# Altium schematic sheet IMU.SchDoc
size B; SheetNumber: 4; SheetTotal: 7
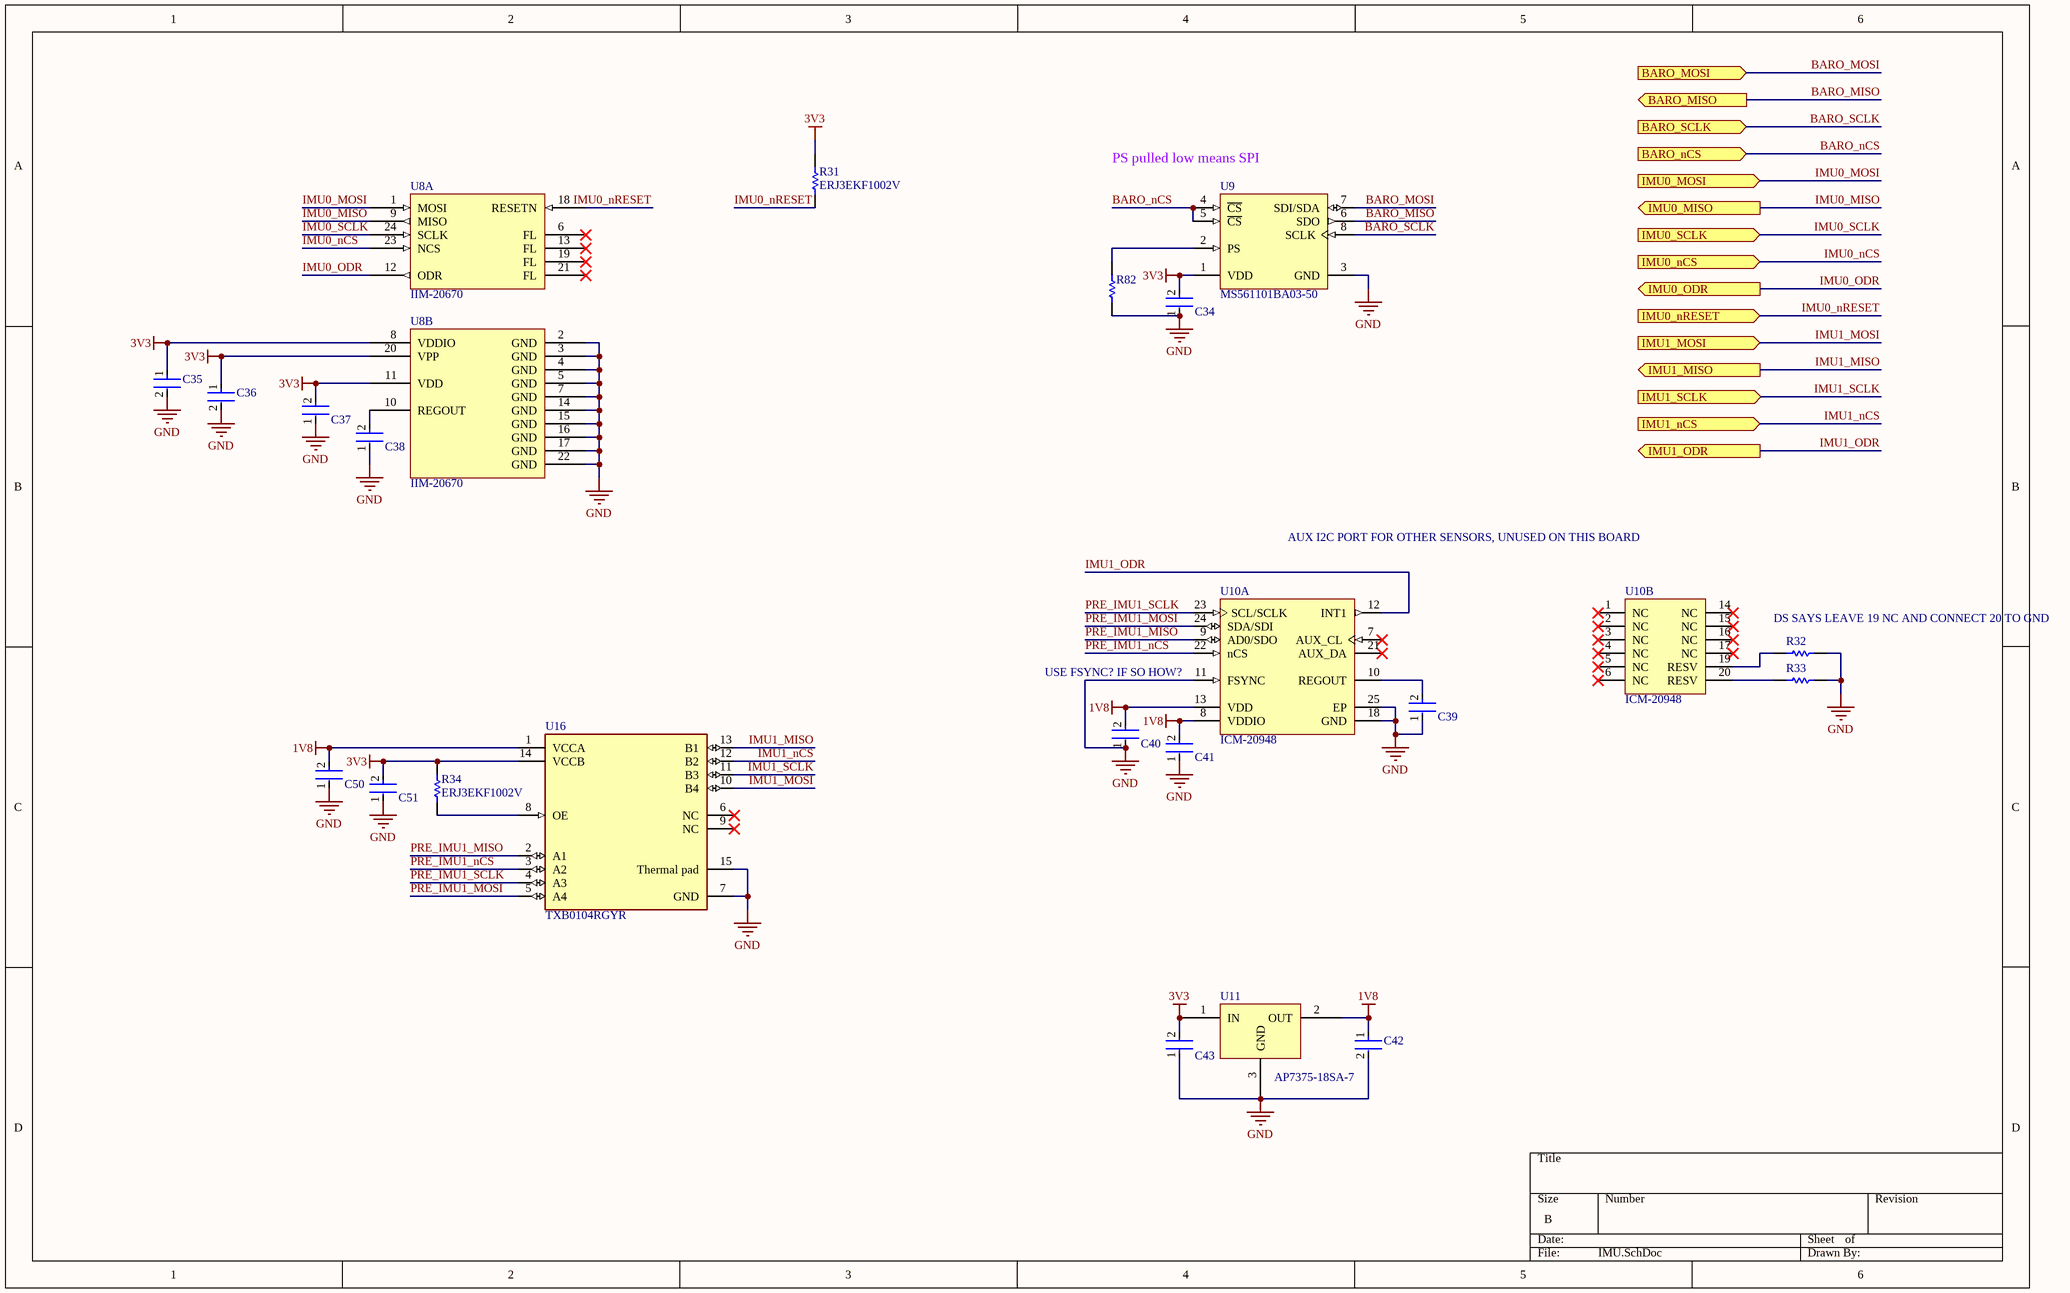
[diagram p0: IMU.SchDoc]

## Parts
C34  GRM155R71C104KA88D  [FP-GRM15-MFG]  (value not drawn)
C35  CC0402KPX7R7BB103  [FP-CC0402-MFG]  (value not drawn)
C36  CC0402KPX7R7BB103  [FP-CC0402-MFG]  (value not drawn)
C37  GRM155R71C104KA88D  [FP-GRM15-MFG]  (value not drawn)
C38  GRM155R71C104KA88D  [FP-GRM15-MFG]  (value not drawn)
C39  GRM155R71C104KA88D  [FP-GRM15-MFG]  (value not drawn)
C40  GRM155R71C104KA88D  [FP-GRM15-MFG]  (value not drawn)
C41  GRM155R71C104KA88D  [FP-GRM15-MFG]  (value not drawn)
C42  CL05A106MP5NUNC  [FP-CL05A106MP5NUNC-MFG]  (value not drawn)
C43  C0402C104K8PACTU  [FP-C0402-BB-MFG]  (value not drawn)
C50  GRM155R71C104KA88D  [FP-GRM15-MFG]  (value not drawn)
C51  GRM155R71C104KA88D  [FP-GRM15-MFG]  (value not drawn)
R31  ERJ3EKF1002V  [RESC1609X55X30LL15T15]
R32  0402 JUMPER  [RESC1005X40X25ML05T05]  (value not drawn)
R33  0402 JUMPER  [RESC1005X40X25ML05T05]  (value not drawn)
R34  ERJ3EKF1002V  [RESC1609X55X30LL15T15]
R82  0402 JUMPER  [RESC1005X40X25ML05T05]  (value not drawn)
U8  IIM-20670  [PQFN50P450X450X115_HS-25N]  (parts A,B of 2)
U9  MS561101BA03-50  [MSI-MS561101BA03-50-8_V]
U10  ICM-20948  [TDK-QFN-24_L]  (parts A,B of 2)
U11  AP7375-18SA-7  [AP7375-18SA-7-Footprint-1]
U16  TXB0104RGYR  [FP-RGY0014A-MFG]

## Ports
BARO_MISO (out, see HYDRA_V3_NAV[5A], STM32H730_PINOUT[7A]), BARO_MOSI (in, see HYDRA_V3_NAV[5A], STM32H730_PINOUT[7A]), BARO_nCS (in, see HYDRA_V3_NAV[5B], STM32H730_PINOUT[7A]), BARO_SCLK (in, see HYDRA_V3_NAV[5A], STM32H730_PINOUT[7A]), IMU0_MISO (out, see HYDRA_V3_NAV[5A], STM32H730_PINOUT[7A]), IMU0_MOSI (in, see HYDRA_V3_NAV[5A], STM32H730_PINOUT[7A]), IMU0_nCS (in, see HYDRA_V3_NAV[5A], STM32H730_PINOUT[7A]), IMU0_nRESET (in, see HYDRA_V3_NAV[5A]), IMU0_ODR (out, see HYDRA_V3_NAV[5A]), IMU0_SCLK (in, see HYDRA_V3_NAV[5A], STM32H730_PINOUT[7A]), IMU1_MISO (out, see HYDRA_V3_NAV[5A], STM32H730_PINOUT[7A]), IMU1_MOSI (in, see HYDRA_V3_NAV[5A], STM32H730_PINOUT[7A]), IMU1_nCS (in, see HYDRA_V3_NAV[5A], STM32H730_PINOUT[7A]), IMU1_ODR (out, see HYDRA_V3_NAV[5A], STM32H730_PINOUT[7A]), IMU1_SCLK (in, see HYDRA_V3_NAV[5A], STM32H730_PINOUT[7A])

## Nets
1V8: C40.2 C41.2 C42.1 C50.2 U10.8(VDDIO) U10.13(VDD) U11.2(OUT) U16.1(VCCA)
3V3: C34.2 C35.1 C36.1 C37.2 C43.2 C51.2 R31.2 R34.2 U8.8(VDDIO) U8.11(VDD) U8.20(VPP) U9.1(VDD) U11.1(IN) U16.14(VCCB)
GND: C34.1 C35.2 C36.2 C37.1 C38.1 C39.1 C40.1 C41.1 C42.2 C43.1 C50.1 C51.1 R32.2 R33.2 R82.1 U8.2(GND) U8.3(GND) U8.4(GND) U8.5(GND) U8.7(GND) U8.14(GND) U8.15(GND) U8.16(GND) U8.17(GND) U8.22(GND) U9.3(GND) U10.11(FSYNC) U10.18(GND) U10.25(EP) U11.3(GND) U16.7(GND) U16.15(Thermal_pad)
BARO_MISO: U9.6(SDO) ; port BARO_MISO
BARO_MOSI: U9.7(SDI/SDA) ; port BARO_MOSI
BARO_nCS: U9.4(~{CS}) U9.5(~{CS}) ; port BARO_nCS
BARO_SCLK: U9.8(SCLK) ; port BARO_SCLK
IMU0_MISO: U8.9(MISO) ; port IMU0_MISO
IMU0_MOSI: U8.1(MOSI) ; port IMU0_MOSI
IMU0_nCS: U8.23(NCS) ; port IMU0_nCS
IMU0_nRESET: R31.1 U8.18(RESETN) ; port IMU0_nRESET
IMU0_ODR: U8.12(ODR) ; port IMU0_ODR
IMU0_SCLK: U8.24(SCLK) ; port IMU0_SCLK
IMU1_MISO: U16.13(B1) ; port IMU1_MISO
IMU1_MOSI: U16.10(B4) ; port IMU1_MOSI
IMU1_nCS: U16.12(B2) ; port IMU1_nCS
IMU1_ODR: U10.12(INT1) ; port IMU1_ODR
IMU1_SCLK: U16.11(B3) ; port IMU1_SCLK
PRE_IMU1_MISO: U10.9(AD0/SDO) U16.2(A1)
PRE_IMU1_MOSI: U10.24(SDA/SDI) U16.5(A4)
PRE_IMU1_nCS: U10.22(nCS) U16.3(A2)
PRE_IMU1_SCLK: U10.23(SCL/SCLK) U16.4(A3)
NetC38_2: C38.2 U8.10(REGOUT)
NetC39_2: C39.2 U10.10(REGOUT)
NetR32_1: R32.1 U10.19(RESV)
NetR33_1: R33.1 U10.20(RESV)
NetR34_1: R34.1 U16.8(OE)
NetR82_2: R82.2 U9.2(PS)

Not connected (* = marked no-connect by the designer): U8 6(FL)* 13(FL)* 19(FL)* 21(FL)*; U10 1(NC)* 2(NC)* 3(NC)* 4(NC)* 5(NC)* 6(NC)* 7(AUX_CL)* 14(NC)* 15(NC)* 16(NC)* 17(NC)* 21(AUX_DA)*; U16 6(NC)* 9(NC)*

## Notes on the sheet
- (near U9) PS pulled low means SPI
- AUX I2C PORT FOR OTHER SENSORS, UNUSED ON THIS BOARD
- (near R32) DS SAYS LEAVE 19 NC AND CONNECT 20 TO GND
- USE FSYNC? IF SO HOW?

## Library data of the parts
C34 C37-C41 C50 C51 = CMP-2100-03641-2: CAP CER 0.1UF 16V X7R 0402; Manufacturer: Murata; Standoff Height: 0mm; Tolerance: 10%; Voltage Rating: 16Vdc; Material: Ceramic; Capacitance: 0.10μF; Value: 0.10μF; RoHS: TRUE; Manufacturer Part Number: GRM155R71C104KA88D; Temperature Characteristic: X7R; Octopart: https://octopart.com/grm155r71c104ka88d-murata-196880; Digikey Description: CAP CER 0.1UF 16V X7R 0402; Device Class L3: Ceramic Capacitors; Height: 0.55mm; ComponentLink2Description: Datasheet; Temperature Range Low: -55°C; Ipc Land Pattern Name: CAPC10050X219; ComponentLink2URL: https://search.murata.co.jp/Ceramy/image/img/A01X/G101/ENG/GRM155R71H471KA01-01A.pdf; Device Class L1: Passive Components; Lead Free: yes; Category: Cap; Package: GRM15; Temperature: -55°C to +125°C; Device Class L2: Capacitors; Temperature Range High: +125°C; Mouser Description: 0402 0.1 uF 16V ±10 % Tolerance X7R SMT Multilayer Ceramic Capacitor
C35 C36 = CMP-03422-000420-1: CC0402 10 nF X7R 10.00% 16 V; Manufacturer: YAGEO; Capacitance: 10 nF; Value: 10 nF; Tolerance: 0.1; Voltage Rating: 16 V; Automotive Grade: NA; Temperature Coefficient: 30ppm/°C; Material: Ceramic; Automotive: No; Device Class L1: Passive Components; Temperature Range Low: -55°C; Ipc Land Pattern Name: CAPC10050X50; Temperature Characteristic: X7R; Lead Free: Yes; Footprint Url: http://www.yageo.com/exep/pages/download/literatures/UPY-C_GEN_24.pdf; Octopart: https://octopart.com/cc0402kpx7r7bb103-yageo-12885102; RoHS: TRUE; Height: 0.55mm; Device Class L3: Ceramic Capacitors; Mouser Description: Multilayer Ceramic Capacitors MLCC - SMD/SMT 10nF 16V X7R 10%; Package: CC0402; ComponentLink2Description: Datasheet; Category: Cap; ComponentLink2URL: http://www.yageo.com/documents/recent/UPY-GP_NP0_16V-to-50V_16.pdf; Temperature: -55°C to +125°C; Manufacturer Part Number: CC0402KPX7R7BB103; Temperature Range High: +125°C; Device Class L2: Capacitors
C42 = CMP-13271-000002-1: CAP CER 10UF 10V X5R 0402; Manufacturer: Samsung; Temperature Coefficient: 15%; Tolerance: 20%; Material: Ceramic; Octopart: https://octopart.com/cl05a106mp5nunc-samsung-22457395; Voltage Rating: 10V; RoHS: TRUE; Value: 10uF; Height: 0.7mm; Digikey Description: CAP CER 10UF 10V X5R 0402; Automotive: No; Package: CL05A106MP5NUNC; Device Class L1: Passive Components; Capacitance: 10uF; Temperature Range High: +85°C; ComponentLink2Description: Datasheet; Device Class L2: Capacitors; Temperature Characteristic: X5R; Manufacturer Part Number: CL05A106MP5NUNC; Temperature: -55°C to +85°C; ComponentLink2URL: http://www.samsungsem.com/kr/support/product-search/mlcc/__icsFiles/afieldfile/2019/05/10/19-CL05A106MP5NUNC.pdf; Device Class L3: Ceramic Capacitors; Category: Cap; Temperature Range Low: -55°C; Ipc Land Pattern Name: CAPC10050X50; Lead Free: Yes
C43 = CMP-2008-02046-2: CAP CER 0.1UF 10V X5R 0402; Manufacturer: Kemet; Material: Ceramic; Capacitance: 0.10 μF; Temperature Coefficient: 15%; Tolerance: 0.1; Value: 0.10 μF; Package: C0402-BB; Temperature: -55°C to +125°C; ComponentLink2Description: Datasheet; Temperature Characteristic: X5R; Device Class L1: Passive Components; Height: 0.55mm; Lead Free: Yes; ComponentLink2URL: https://content.kemet.com/datasheets/KEM_C1002_X7R_SMD.pdf; Device Class L2: Capacitors; Temperature Range Low: -55°C; Temperature Range High: +125°C; RoHS: TRUE; Octopart: https://octopart.com/c0402c104k8pactu-kemet-140039; Automotive: No; Mouser Description: Capacitor 100 nF 10 VDC 0402; Category: Cap; Voltage Rating: 10 V; Digikey Description: CAP CER 0.1UF 10V X5R 0402; Ipc Land Pattern Name: CAPC10050X50; Device Class L3: Ceramic Capacitors; Manufacturer Part Number: C0402C104K8PACTU
R31 R34 = CMP-1012-00623-3: Chip Resistor, 10 KOhm, +/- 1%, 0.1 W, -55 to 155 degC, 0603 (1608 Metric), RoHS, Tape and Reel; Manufacturer: Panasonic; Voltage Rating: 75V; Case\/Package: 0603; Power Rating: 100mW; Resistance: 10KOhm; Temperature Coefficient: 100ppm\/degreesC; Number of Pins: 2; Package Reference: 603; Depth: 0.8mm; Mount: SurfaceMount; Package Description: 2-Pin Surface Mount Device, Body 1.6 x 0.85 mm; Datasheet Version: 02/2017; Length: 1.6mm; Lead Free: LeadFree; Height: 0.45mm; Number of Terminations: 2; Max Power Dissipation: 100mW; Min Operating Temperature: -55degC; Datasheet URL: https://industrial.panasonic.com/cdbs/www-data/pdf/RDA0000/AOA0000C304.pdf; Termination: SMD/SMT; Case Code (Metric): 1608; Case Code (Imperial): 0603; Tolerance: 1%; Max Operating Temperature: 155degC; RoHSCompliant: true; Voltage Rating (DC): 75V; Radiation Hardening: No; Packaging: TapeandReel; Composition: ThickFilm; Mounting Technology: SurfaceMount; Manufacturer URL: http://www.panasonic.com/; Width: 0.031inch; REACH SVHC: NoSVHC; Contact Plating: Tin; Military Standard: Not; Package Quantity: 1
R32 R33 R82 = CMP-009-00118-2: READ THE NAME; Pins: 2; Component Type: Standard; Design Item ID: CMP-009-00206-2; Source: 0402jump.SchLib
U8 = CMP-010-00029-2: 6-axis IMU with extended temperature range and high VRE performance
U9 = CMP-2000-05251-1: Barometric Pressure Sensor, with Stainless Steel Cap, 1.8 to 3.6 V, -45 to 85 degC, 8-Pin QFN, RoHS, Tape and Reel; Manufacturer: Measurement Specialties; Operating Pressure Max: 1200mbar; Supply Current: 12.5µA; Supply Voltage Max: 3.6V; Supply Voltage Min: 1.8V; No. of Pins: 8; Connection Size: 0.5mm; SVHC: NoSVHC(20-Jun-2013); Operating Pressure Min: 10mbar; Manufacturer URL: http://www.meas-spec.com/; Operating Temperature Min: -40degC; Pressure Type: Barometric; Package Reference: MS561101BA03-50-8; Datasheet URL: http://www.te.com/commerce/DocumentDelivery/DDEController?Action=srchrtrv&DocNm=MS5611-01BA03&DocType=Data+Sheet&DocLang=English&DocFormat=pdf&PartCntxt=CAT-BLPS0036; Package Description: 8-Pin Surface Mount Device, Body 5 x 3 mm, Pitch 1.25 mm; Sensor Case Style: QFN; Datasheet Version: Sep-15; Operating Temperature Max: 85degC
U10 = CMP-2000-07532-1: World’s Lowest Power 9-Axis MEMS MotionTracking(TM) Device, 1.71 to 3.6 V, -40 to 85 degC, 24-Pin QFN, RoHS, Tape and Reel; Manufacturer: TDK; Package Description: 24-Pin Quad Flat No-lead Package, Body 3 x 3 mm, Pitch 0.4 mm; Datasheet Version: Rev. 1.3, 06/2017; Package Reference: QFN-24; Mounting Technology: SurfaceMount; Datasheet URL: https://www.invensense.com/wp-content/uploads/2016/06/DS-000189-ICM-20948-v1.3.pdf; Manufacturer URL: http://www.tdk.com/
U11 = CMP-019-00042-1: Fixed Positive LDO Regulator; RoHS Compliant: Yes
U16 = CMP-04899-000011-1: IC TRNSLTR BIDIRECTIONAL 14VQFN; Manufacturer: Texas Instruments; Standoff Height: 0mm; V B Min: 1.65V; Data Rate: 100Mbits/s; Number Of Circuits: 1; V B Max: 5.5V; Number Of Inputs: 4; Logic Function Desc: Non-Inverting; Max Junction Temp: +150°C; V A Min: 1.2V; Nominal Supply Current: 0.06-3.5uA; V A Max: 3.6V; Propagation Delay: 4ns; Device Class L1: Integrated Circuits (ICs); ComponentLink2Description: Datasheet; Mouser Description: 4-Bit Bidirectional Voltage-Level Shifter with Auto Direction Sensing and +/-15 kV ESD Protect 14-VQFN -40 to 85; Ambient Temperature Range Low: -40°C; Temperature: -40°C to +85°C; RoHS: TRUE; Digikey Description: IC TRNSLTR BIDIRECTIONAL 14VQFN; Manufacturer Part Number: TXB0104RGYR; Lead Free: Yes; Octopart: https://octopart.com/txb0104rgyr-texas+instruments-1485948; Height: 1mm; Device Class L3: Voltage Level Shifters; Category: IC; Device Class L2: Logic ICs; Temperature Range Low: -40°C; Number Of Outputs: 4; Temperature Range High: +85°C; Package: RGY0014A; Automotive: No; Ambient Temperature Range High: +85°C; Min Supply Voltage: 1.2V; ComponentLink2URL: http://www.ti.com/lit/ds/symlink/txb0104.pdf; Max Supply Voltage: 5.5V